# EAGLE design untitled (EAGLE 6.1)
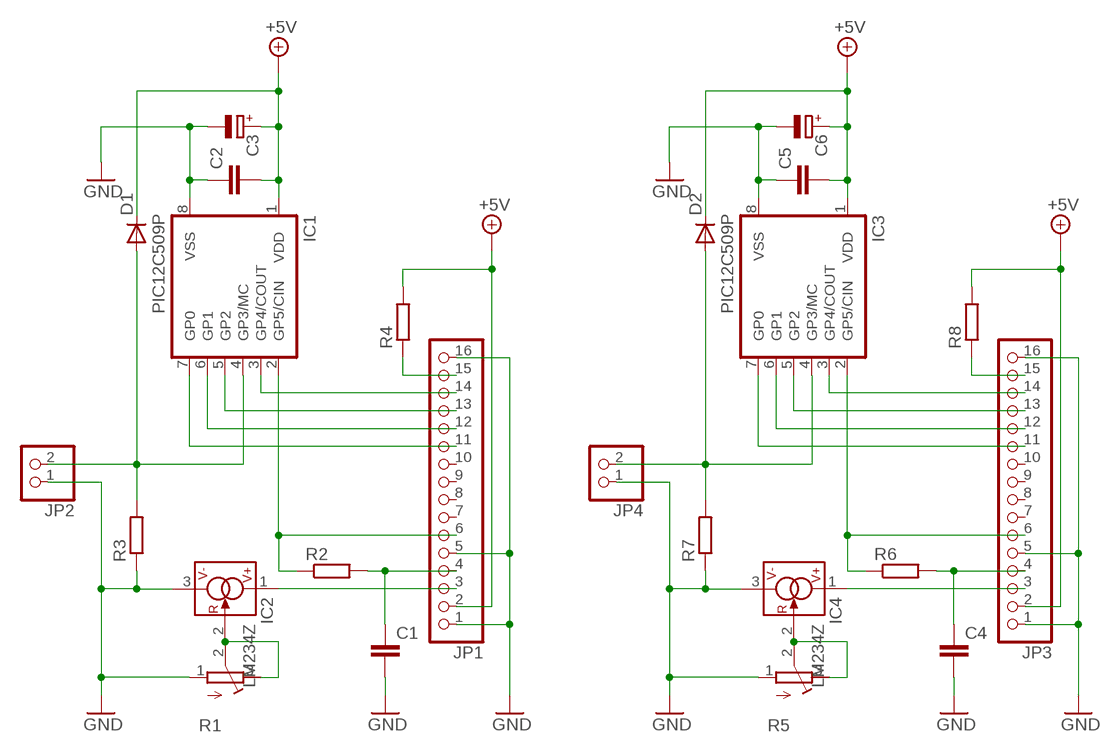
[diagram p0: schematic, sheet 1]

## Parts
C1  C-EU025-025X050  [C025-025X050]
C2  C-EU025-025X050  [C025-025X050]
C3  CPOL-EUTT2D5L  [TT2D5L]
C4  C-EU025-025X050  [C025-025X050]
C5  C-EU025-025X050  [C025-025X050]
C6  CPOL-EUTT2D5L  [TT2D5L]
D1  DIODE-DO34-7  [DO34-7]
D2  DIODE-DO34-7  [DO34-7]
IC1  PIC12C509P  [DIL8]
IC2  LM234Z  [TO92]
IC3  PIC12C509P  [DIL8]
IC4  LM234Z  [TO92]
JP1  PINHD-1X16  [1X16]
JP2  PINHD-1X2/90  [1X02/90]
JP3  PINHD-1X16  [1X16]
JP4  PINHD-1X2/90  [1X02/90]
R1  R-TRIMM3296P  [RTRIM3296P]
R2  R-EU_0204/7  [0204/7]
R3  R-EU_0204/7  [0204/7]
R4  R-EU_0204/7  [0204/7]
R5  R-TRIMM3296P  [RTRIM3296P]
R6  R-EU_0204/7  [0204/7]
R7  R-EU_0204/7  [0204/7]
R8  R-EU_0207/12  [0207/12]

## Nets
+5V: C2.2 C3.+ C5.2 C6.+ D1.C D2.C IC1.1(VDD) IC3.1(VDD) JP1.2 JP3.2 R4.2 R8.2
GND: C1.2 C2.1 C3.- C4.2 C5.1 C6.- IC1.8(VSS) IC2.3(V-) IC3.8(VSS) IC4.3(V-) JP1.1 JP1.5 JP1.16 JP2.1 JP3.1 JP3.5 JP3.16 JP4.1 R1.1(A) R3.1 R5.1(A) R7.1
N$1: IC2.1(V+) JP1.3
N$2: C1.1 JP1.4 R2.2
N$3: D1.A IC1.4(GP3/MC) JP2.2 R3.2
N$4: IC1.2(GP5/CIN) JP1.6 R2.1
N$5: IC2.2(R) R1.2(S) R1.3(E)
N$6: IC4.1(V+) JP3.3
N$7: IC3.2(GP5/CIN) JP3.6 R6.1
N$8: IC3.7(GP0) JP3.11
N$9: IC1.7(GP0) JP1.11
N$10: IC1.6(GP1) JP1.12
N$11: IC1.5(GP2) JP1.13
N$12: IC1.3(GP4/COUT) JP1.14
N$13: JP1.15 R4.1
N$14: IC3.6(GP1) JP3.12
N$15: IC3.5(GP2) JP3.13
N$16: IC3.3(GP4/COUT) JP3.14
N$17: JP3.15 R8.1
N$18: D2.A IC3.4(GP3/MC) JP4.2 R7.2
N$19: C4.1 JP3.4 R6.2
N$20: IC4.2(R) R5.2(S) R5.3(E)
Unconnected: JP1.7 JP1.8 JP1.9 JP1.10 JP3.7 JP3.8 JP3.9 JP3.10

## Library data of the parts
C1 C2 C4 C5 = rcl:C-EU: CAPACITOR, European symbol
C3 C6 = rcl:CPOL-EU: POLARIZED CAPACITOR, European symbol
D1 D2 = diode:DIODE-: DIODE
IC1 IC3 = microchip:PIC12C*?: MICROCONTROLLER; MF: MICROCHIP; MPN: PIC12C509-04/P; OC_FARNELL: 9758810; OC_NEWARK: 54K2820
IC2 IC4 = linear:LM*34: 3-Terminal Adjustable Current Sources Source: www.national.com/pf/LM/LM334.html | LM134.pdf
JP1 JP3 = pinhead:PINHD-1X16: PIN HEADER
JP2 JP4 = pinhead:PINHD-1X2: PIN HEADER
R1 R5 = rcl:R-TRIMM: Trimm resistor
R2-R4 R6-R8 = rcl:R-EU_: RESISTOR, European symbol

## Board
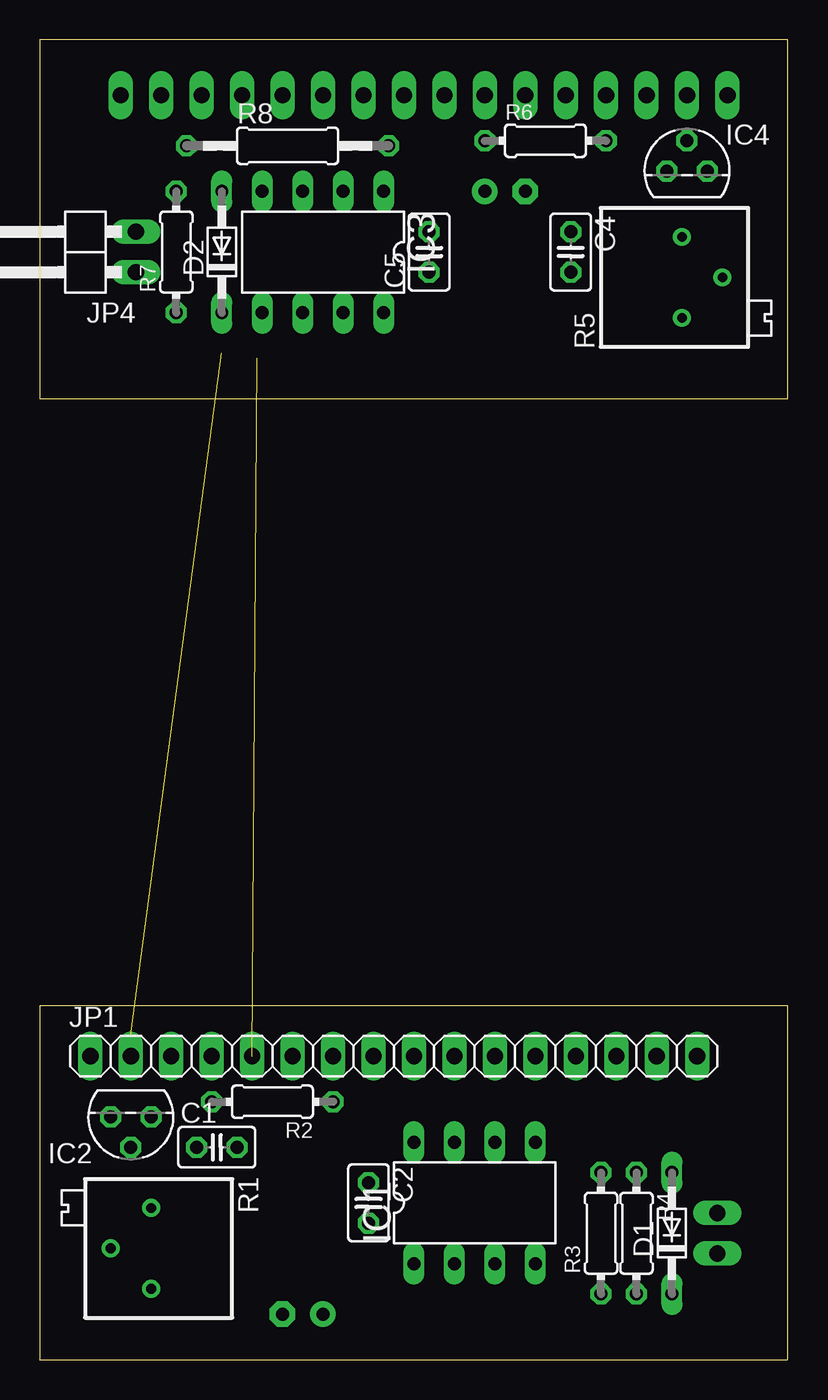
[diagram p1: board, top side]
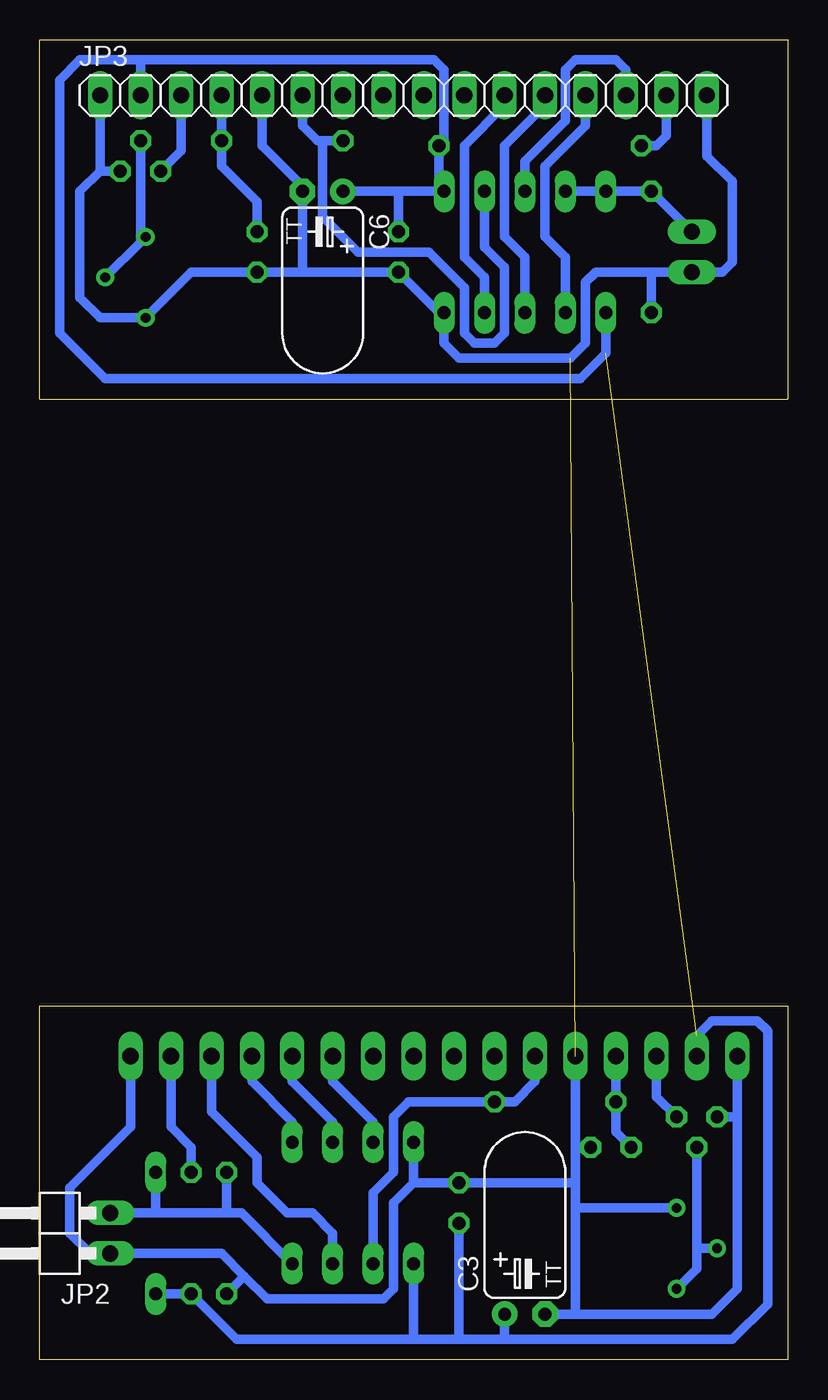
[diagram p2: board, bottom side, seen from below]

Size 46.97 x 82.85 mm. Coordinates in mm from the lower left corner, seen from the top.
Outline: 0,0 46.97,0 46.97,22.21 0,22.21 0,0
Outline: 46.97,60.31 46.97,82.85 0,82.85 0,60.31 46.97,60.31
Copper layers (1*16): Top 0.035mm / dielectric 1.5mm / Bottom 0.035mm
Design rules: minimum track width 10mil, minimum drill 24mil, track to track 8mil, track to pad 8mil, pad to pad 8mil, via to via 8mil, smd to smd 8mil, copper to edge 40mil, drill to drill 8mil, minimum pad ring 10mil, minimum via ring 8mil, stop-mask expansion 4mil, vias tented up to drill 0mil, thermal gap 10mil

### Footprints (pad centres in the part's own frame; a part is rotated, then mirrored left to right if it is on the bottom)
C025-025X050 = drill 0.813 octagon: 1 -1.27,0; 2 1.27,0
TT2D5L = drill 0.813 pad 1.6: + -1.27,0 | drill 0.813 pad 1.6 octagon: - 1.27,0
DO34-7 = drill 0.813 long: A 3.81,0; C -3.81,0
DIL8 = drill 0.813 long: 1 -3.81,-3.81; 2 -1.27,-3.81; 3 1.27,-3.81; 4 3.81,-3.81; 5 3.81,3.81; 6 1.27,3.81; 7 -1.27,3.81; 8 -3.81,3.81
TO92 = drill 0.813 octagon: 1 -1.27,0; 2 0,1.905; 3 1.27,0
1X16 = drill 1.016 long: 1 -19.05,0; 2 -16.51,0; 3 -13.97,0; 4 -11.43,0; 5 -8.89,0; 6 -6.35,0; 7 -3.81,0; 8 -1.27,0; 9 1.27,0; 10 3.81,0; 11 6.35,0; 12 8.89,0; 13 11.43,0; 14 13.97,0; 15 16.51,0; 16 19.05,0
1X02/90 = drill 1.016 long: 1 -1.27,-3.81; 2 1.27,-3.81
RTRIM3296P = drill 0.61: 1 0,-2.54; 2 2.54,0; 3 0,2.54
0204/7 = drill 0.813 octagon: 1 -3.81,0; 2 3.81,0
0207/12 = drill 0.813 octagon: 1 -6.35,0; 2 6.35,0

### Placement (x,y rotation side)
C1  11.11,13.33 0 top
C2  20.64,9.84 270 top
C3  16.51,2.86 0 bottom
C4  33.34,69.53 270 top
C5  24.45,69.53 90 top
C6  29.21,73.34 180 bottom
D1  39.69,7.94 90 top
D2  11.43,69.53 90 top
IC1  27.3,9.84 0 top
IC2  5.71,15.24 180 top
IC3  17.78,69.53 180 top
IC4  40.64,74.61 0 top
JP1  22.23,19.05 0 top
JP2  46.35,7.94 90 bottom
JP3  24.13,79.38 0 bottom
JP4  2.22,69.53 90 top
R1  6.99,6.98 180 top
R2  14.61,16.19 180 top
R3  35.24,7.94 90 top
R4  37.47,7.94 270 top
R5  40.32,67.94 0 top
R6  31.75,76.52 0 top
R7  8.57,69.53 90 top
R8  15.56,76.2 0 top

### Tracks (layer width: path | path; a pad name or v marks a point on that pad's centre or on a via)
+5V  (1 unrouted)
  Bottom 0.61: JP1.2 5.71,20.32 4.76,21.27 1.91,21.27 1.27,20.64 1.27,3.49 3.49,1.27 17.78,1.27 | 17.78,1.27 20.64,1.27 | 20.64,1.27 23.5,1.27 | 23.5,1.27 34.61,1.27 R4.2 D1.C | IC1.1 23.5,1.27 | C3.+ 17.78,1.27 | IC3.1 21.91,73.34 | 21.91,73.34 24.45,73.34 | 24.45,73.34 C6.+ | C5.2 24.45,73.34 | JP3.2 40.64,81.6 | 40.64,81.6 44.45,81.6 45.72,80.33 45.72,64.45 42.86,61.59 13.02,61.59 11.43,63.18 D2.C | 40.64,81.6 22.23,81.6 21.59,80.96 21.59,76.52 R8.2 21.91,73.34 | C2.2 20.64,1.27
GND  (1 unrouted)
  Bottom 0.61: JP1.1 3.17,15.24 | 3.17,15.24 3.17,4.45 4.76,2.86 13.34,2.86 | IC2.3 3.17,15.24 | 13.34,2.86 C3.- 14.29,2.86 | JP1.5 13.34,13.33 | 13.34,13.33 13.34,11.11 | 13.34,11.11 13.34,9.52 | 13.34,11.11 C2.1 23.5,11.11 | R1.1 13.34,9.52 | 13.34,9.52 13.34,2.86 | 34.13,5.24 32.7,3.81 25.4,3.81 24.77,4.45 24.77,9.84 23.5,11.11 | 34.13,5.24 35.56,6.67 JP2.1 43.81,6.67 45.09,7.94 45.09,10.79 41.27,14.61 JP1.16 | R3.1 34.13,5.24 | JP3.1 43.18,74.61 | 21.59,65.4 C5.1 30.48,68.26 | 21.59,65.4 21.59,63.82 20.64,62.86 13.65,62.86 12.7,63.82 12.7,67.63 12.06,68.26 8.57,68.26 | 30.48,68.26 C6.- 30.48,73.66 33.02,76.2 JP3.5 | 30.48,68.26 C4.2 37.47,68.26 R5.1 43.18,65.4 44.45,66.67 44.45,73.34 43.18,74.61 | 43.18,74.61 IC4.3 | IC1.8 23.5,11.11 | 8.57,68.26 JP4.1 4.13,68.26 3.49,68.9 3.49,73.98 5.08,75.56 JP3.16 | 8.57,68.26 R7.1 | 21.59,65.4 IC3.8 | C1.2 13.34,13.33
N$1
  Bottom 0.61: IC2.1 8.26,16.51 JP1.3
N$2
  Bottom 0.61: JP1.4 R2.2 10.79,14.29 C1.1
N$3
  Bottom 0.61: 39.69,9.21 35.24,9.21 | 35.24,9.21 34.29,9.21 IC1.4 | R3.2 35.24,9.21 | D1.A 39.69,9.21 | 39.69,9.21 JP2.2
N$4
  Bottom 0.61: JP1.6 15.88,17.46 17.14,16.19 R2.1 23.81,16.19 24.77,15.24 24.77,11.75 26.04,10.48 IC1.2
N$5
  Bottom 0.61: IC2.2 5.71,6.99 | 5.71,6.99 5.71,5.71 R1.3 | R1.2 5.71,6.99
N$6
  Bottom 0.61: JP3.3 38.1,75.88 IC4.1
N$7
  Bottom 0.61: JP3.6 30.48,77.47 29.53,76.52 29.21,76.52 | R6.1 29.21,76.52 | 29.21,76.52 29.21,71.75 26.99,69.53 22.54,69.53 20.32,67.31 20.32,64.45 19.68,63.82 18.41,63.82 17.78,64.45 17.78,68.58 19.05,69.85 IC3.2
N$8
  Bottom 0.61: JP3.11 17.78,78.74 20.32,76.2 20.32,69.22 19.05,67.95 IC3.7
N$9
  Bottom 0.61: IC1.7 26.04,14.92 28.57,17.46 JP1.11
N$10
  Bottom 0.61: IC1.6 28.57,14.92 31.11,17.46 JP1.12
N$11
  Bottom 0.61: IC1.5 31.11,14.92 33.66,17.46 JP1.13
N$12
  Bottom 0.61: JP1.14 36.2,15.56 33.34,12.7 33.34,11.11 31.43,9.21 29.84,9.21 28.57,7.94 IC1.3
N$13
  Bottom 0.61: R4.1 37.47,13.33 38.73,14.61 JP1.15
N$14
  Bottom 0.61: JP3.12 15.24,78.74 17.78,76.2 17.78,70.49 16.51,69.22 IC3.6
N$15
  Bottom 0.61: JP3.13 12.7,77.47 15.24,74.93 15.24,70.49 13.97,69.22 IC3.5
N$16
  Bottom 0.61: JP3.14 10.16,80.96 10.79,81.6 13.34,81.6 13.97,80.96 13.97,77.79 16.51,75.25 IC3.3
N$17
  Bottom 0.61: JP3.15 7.62,76.84 8.26,76.2 R8.1
N$18
  Bottom 0.61: JP4.2 R7.2 D2.A IC3.4
N$19
  Bottom 0.61: JP3.4 R6.2 35.56,74.93 33.34,72.71 C4.1
N$20
  Bottom 0.61: IC4.2 40.64,70.49 | 40.64,70.49 40.64,70.17 R5.2 | R5.3 40.64,70.49